# Altium project slave.PrjPcb
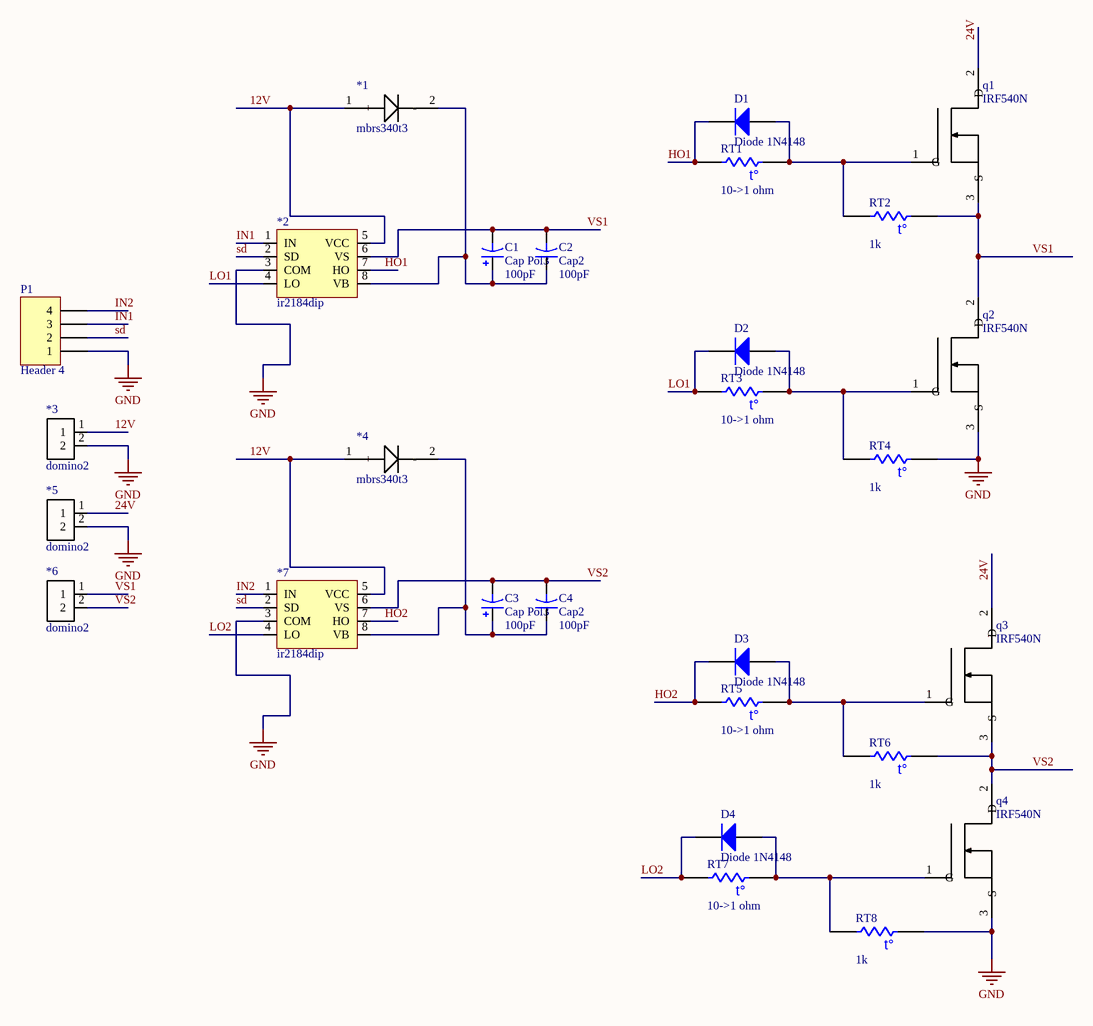
[diagram p0: Sheet1.SchDoc]
1 sheet, 28 parts. Net scope: global (net labels, ports and power ports of the same name join across sheets).
Board file: slave.PcbDoc

## Sheet Sheet1.SchDoc
size A1

### Parts
*1  mbrs340t3  [diode mbrs34ot3]
*2  ir2184dip  [ir2101]
*3  domino2  [Domino_2]
*4  mbrs340t3  [diode mbrs34ot3]
*5  domino2  [Domino_2]
*6  domino2  [Domino_2]
*7  ir2184dip  [ir2101]
C1  Cap Pol3  value 100pF  [C0805]
C2  Cap2  value 100pF  [CAPR5-4X5]
C3  Cap Pol3  value 100pF  [C0805]
C4  Cap2  value 100pF  [CAPR5-4X5]
D1  Diode 1N4148  [DO-35]
D2  Diode 1N4148  [DO-35]
D3  Diode 1N4148  [DO-35]
D4  Diode 1N4148  [DO-35]
P1  Header 4  [HDR1X4]
q1  IRF540N  [TO220]
q2  IRF540N  [TO220]
q3  IRF540N  [TO220]
q4  IRF540N  [TO220]
RT1  10->1 ohm  [6-0805_N]
RT2  1k  [6-0805_N]
RT3  10->1 ohm  [6-0805_N]
RT4  1k  [6-0805_N]
RT5  10->1 ohm  [6-0805_N]
RT6  1k  [6-0805_N]
RT7  10->1 ohm  [6-0805_N]
RT8  1k  [6-0805_N]

### Nets
GND: *2.3(COM) *3.2 *5.2 *7.3(COM) P1.1 q2.3(S) q4.3(S) RT4.1 RT8.1
12V: *1.1(+) *2.5(VCC) *3.1 *4.1(+) *7.5(VCC)
24V: *5.1 q1.2(D) q3.2(D)
HO1: *2.7(HO) D1.2(K) RT1.2
HO2: *7.7(HO) D3.2(K) RT5.2
IN1: *2.1(IN) P1.3
IN2: *7.1(IN) P1.4
LO1: *2.4(LO) D2.2(K) RT3.2
LO2: *7.4(LO) D4.2(K) RT7.2
sd: *2.2(SD) *7.2(SD) P1.2
VS1: *2.6(VS) *6.1 C1.2 C2.2 q1.3(S) q2.2(D) RT2.1
VS2: *6.2 *7.6(VS) C3.2 C4.2 q3.3(S) q4.2(D) RT6.1
Net*1_2: *1.2(-) *2.8(VB) C1.1 C2.1
Net*4_2: *4.2(-) *7.8(VB) C3.1 C4.1
NetD1_1: D1.1(A) q1.1(G) RT1.1 RT2.2
NetD2_1: D2.1(A) q2.1(G) RT3.1 RT4.2
NetD3_1: D3.1(A) q3.1(G) RT5.1 RT6.2
NetD4_1: D4.1(A) q4.1(G) RT7.1 RT8.2

### Notes on the sheet
- (in symbol Res Thermal) t°

### Library data of the parts
C1 C3 = Cap Pol3: Polarized Capacitor (Surface Mount); Published: 8-Jun-2000; LatestRevisionDate: 29-May-2009; LatestRevisionNote: IPC-7351 Footprint Added.; PackageReference: C0805; Publisher: Altium Limited; PackageDescription: Chip Capacitor
C2 C4 = Cap2: Capacitor; Published: 23-Sep-2002; PackageReference: CAPR5-4X5; Publisher: Altium Limited; PackageDescription: Capacitor; 2 Leads
D1-D4 = Diode 1N4148: High Conductance Fast Diode; Published: 8-Jun-2000; LatestRevisionDate: 17-Jul-2002; LatestRevisionNote: Re-released for DXP Platform.; DatasheetVersion: 1997; PackageReference: DO-35; Publisher: Altium Limited; PackageDescription: Diode, Axial; Body 3.8 x 1.9 mm (LxDia. max), Lead Dia. 0.53 mm (max); Code_JEDEC: DO-204-AH; ComponentLink1Description: Manufacturer Link; ComponentLink1URL: http://www.fairchildsemi.com/; ComponentLink2Description: Datasheet; ComponentLink2URL: http://www.fairchildsemi.com/ds/1N%2F1N4148.pdf
P1 = Header 4: Header, 4-Pin; LatestRevisionDate: 17-Jul-2002; LatestRevisionNote: Re-released for DXP Platform.; Publisher: Altium Limited
RT1-RT8 = Res Thermal: Thermistor; Published: 24-Mar-1999; LatestRevisionDate: 29-May-2009; LatestRevisionNote: IPC-7351 Footprint Added.; PackageVersion: Mar-2003; PackageReference: 6-0805; Publisher: Altium Limited; PackageDescription: Chip Resistor 0805 Case Size; Code_IPC: RESC2012